# Altium schematic sheet MCU.SchDoc: ESP32-PICO, STM32F4
size 420 x 297 mm; SheetNumber: 6
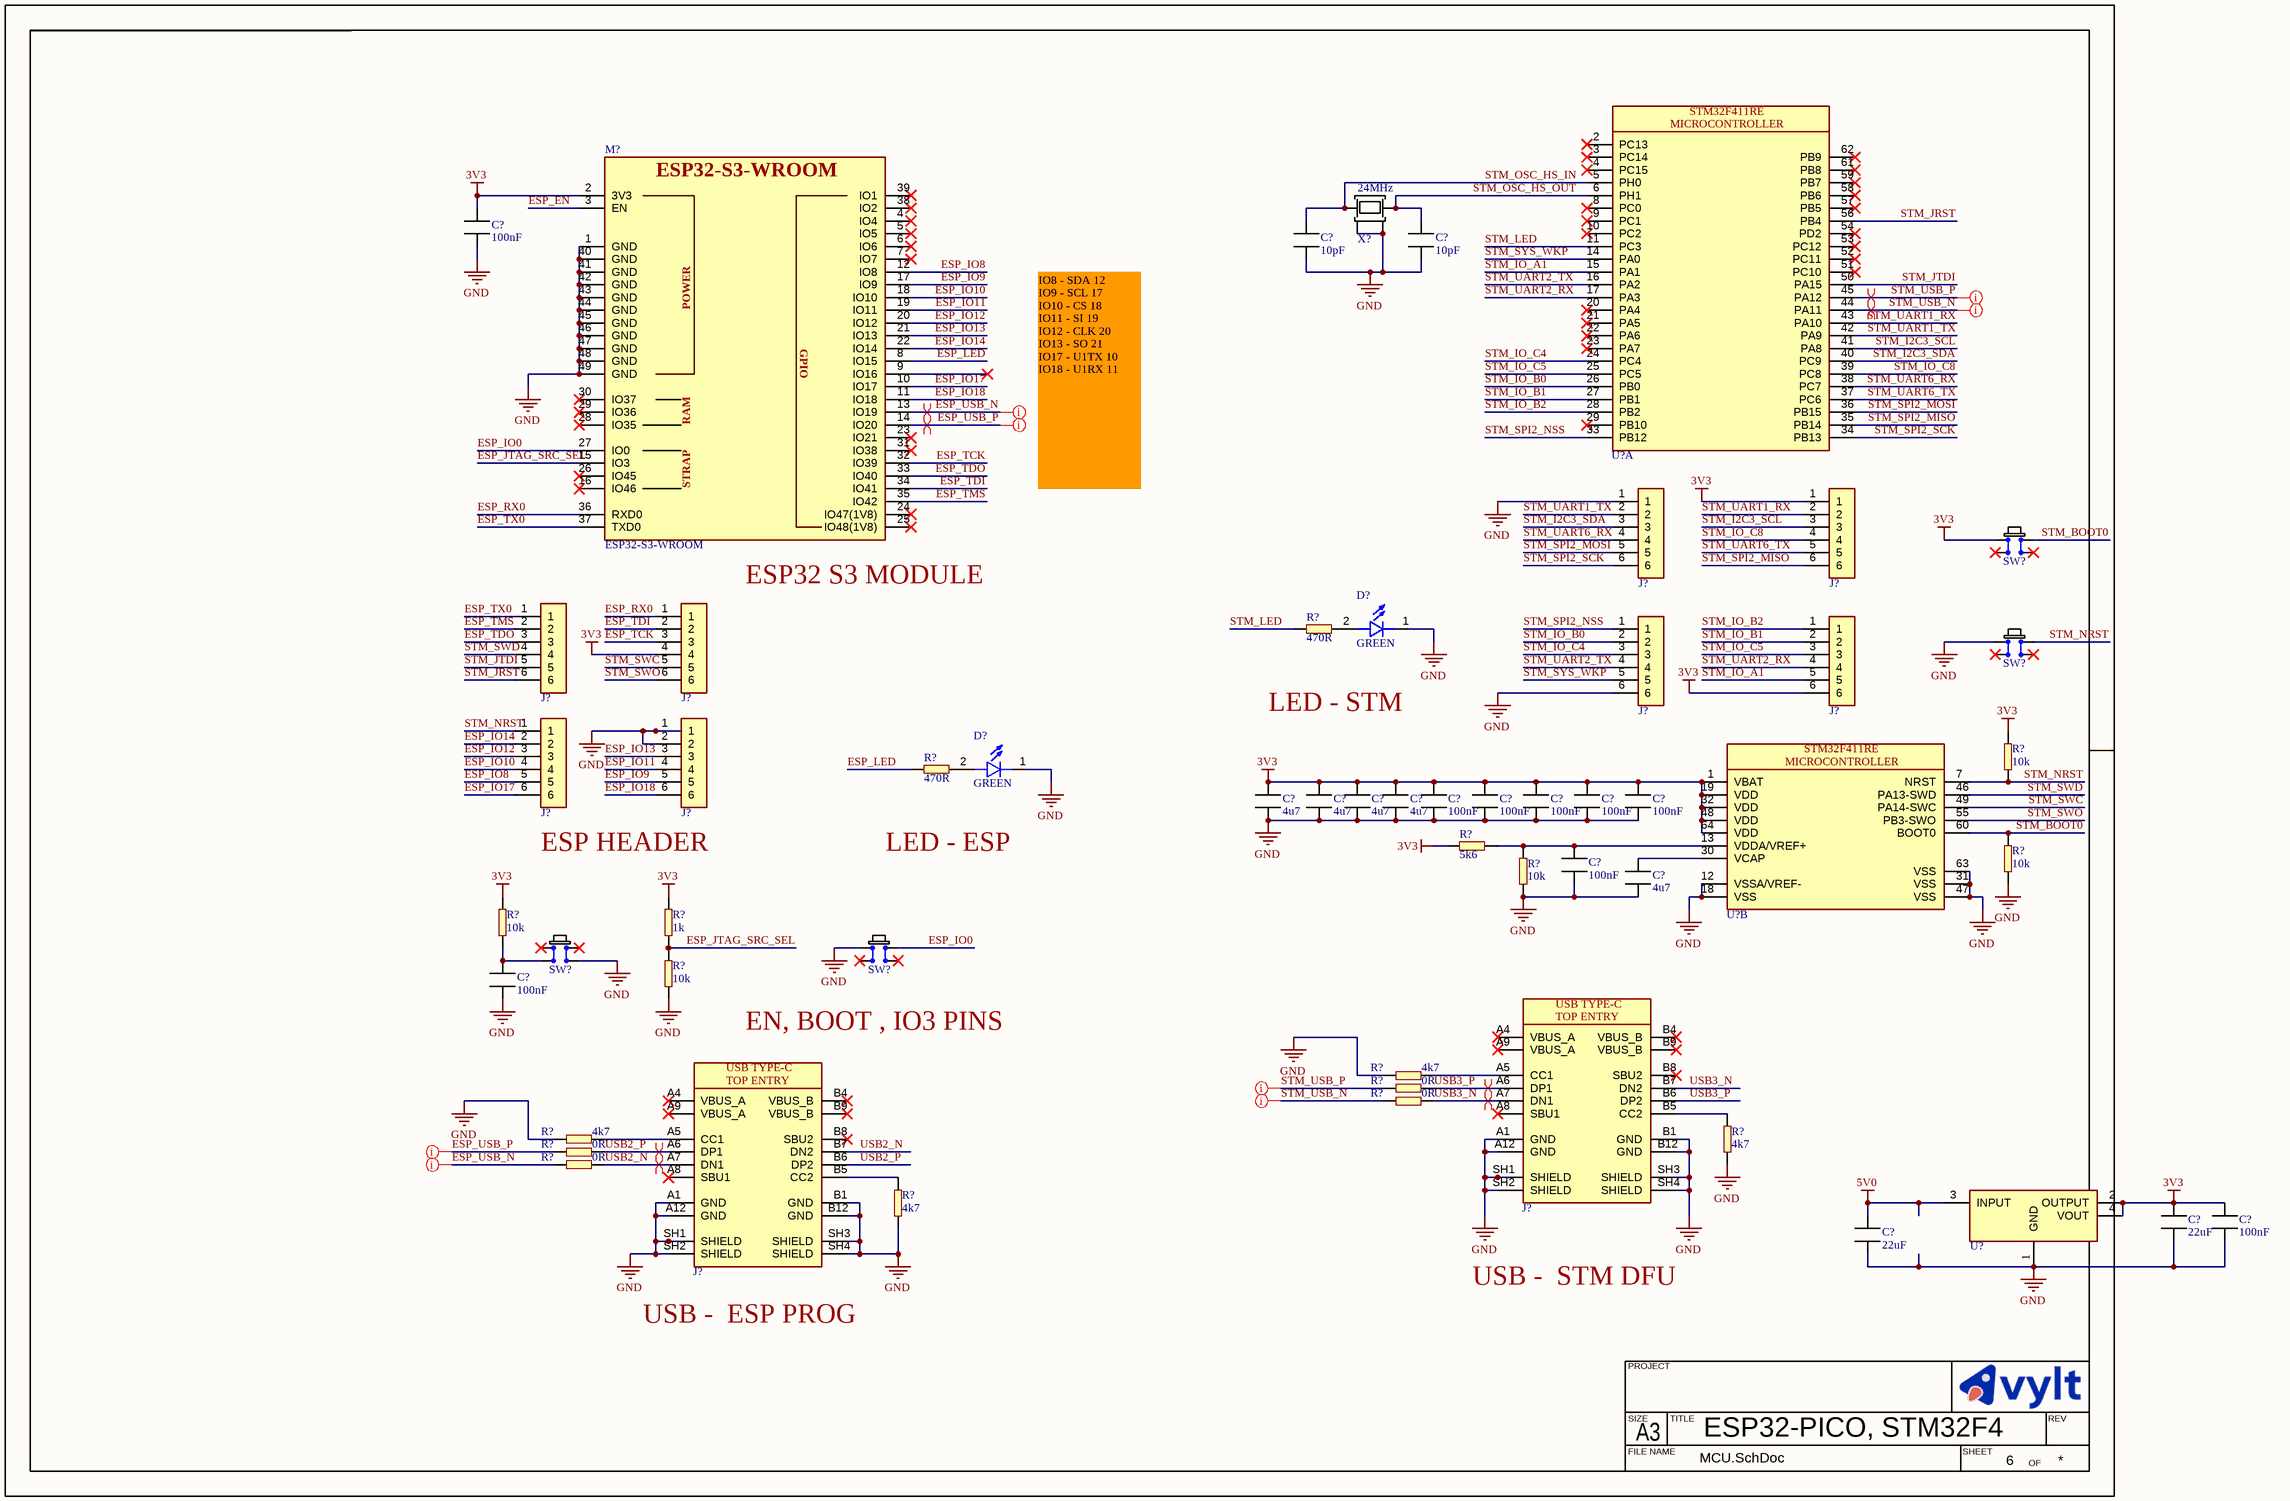
[diagram p0: MCU.SchDoc]

## Parts
(Parts that share a designator on the sheet are numbered #1, #2 ... from top to bottom, then left to right.)
C?#1  value 10pF  [CAPC2012X13L]  (hidden comment: MLCC_0805)
C?#2  value 10pF  [CAPC2012X13L]  (hidden comment: MLCC_0805)
C?#3  value 100nF  [CAPC2012X13L]  (hidden comment: MLCC_0805)
C?#4  value 4u7  [CAPC2012X13L]  (hidden comment: MLCC_0805)
C?#5  value 4u7  [CAPC2012X13L]  (hidden comment: MLCC_0805)
C?#6  value 4u7  [CAPC2012X13L]  (hidden comment: MLCC_0805)
C?#7  value 4u7  [CAPC2012X13L]  (hidden comment: MLCC_0805)
C?#8  value 100nF  [CAPC2012X13L]  (hidden comment: MLCC_0805)
C?#9  value 100nF  [CAPC2012X13L]  (hidden comment: MLCC_0805)
C?#10  value 100nF  [CAPC2012X13L]  (hidden comment: MLCC_0805)
C?#11  value 100nF  [CAPC2012X13L]  (hidden comment: MLCC_0805)
C?#12  value 100nF  [CAPC2012X13L]  (hidden comment: MLCC_0805)
C?#13  value 100nF  [CAPC2012X13L]  (hidden comment: MLCC_0805)
C?#14  value 4u7  [CAPC2012X13L]  (hidden comment: MLCC_0805)
C?#15  value 100nF  [CAPC2012X13L]  (hidden comment: MLCC_0805)
C?#16  value 22uF  [CAPC2012X13L]  (hidden comment: MLCC_0805)
C?#17  value 100nF  [CAPC2012X13L]  (hidden comment: MLCC_0805)
C?#18  value 22uF  [CAPC2012X13L]  (hidden comment: MLCC_0805)
D?#1  value GREEN  [LED_1206]  (hidden comment: LED_1206)
D?#2  value GREEN  [LED_1206]  (hidden comment: LED_1206)
J?#1  ERP_148-2  [6PX1R_F]  (value not drawn)
J?#2  ERP_148-2  [6PX1R_F]  (value not drawn)
J?#3  ERP_148-2  [6PX1R_F]  (value not drawn)
J?#4  ERP_148-2  [6PX1R_F]  (value not drawn)
J?#5  ERP_148-2  [6PX1R_F]  (value not drawn)
J?#6  ERP_148-2  [6PX1R_F]  (value not drawn)
J?#7  ERP_148-2  [6PX1R_F]  (value not drawn)
J?#8  ERP_148-2  [6PX1R_F]  (value not drawn)
J?#9  GSB1CA11101DSHR  [GSB1CA11101DSHR]  (value not drawn)
J?#10  GSB1CA11101DSHR  [GSB1CA11101DSHR]  (value not drawn)
M?  value ESP32-S3-WROOM  [ESP32-S3-WROOM-1U]  (hidden comment: ESP32-S3-WROOM-1(U))
R?#1  value 470R  [RES_0603]  (hidden comment: ERP_101-1)
R?#2  value 470R  [RES_0603]  (hidden comment: ERP_101-1)
R?#3  value 10k  [RES_0603]  (hidden comment: ERP_101-1)
R?#4  value 10k  [RES_0603]  (hidden comment: ERP_101-1)
R?#5  value 5k6  [RES_0603]  (hidden comment: ERP_101-1)
R?#6  value 10k  [RES_0603]  (hidden comment: ERP_101-1)
R?#7  value 10k  [RES_0603]  (hidden comment: ERP_101-1)
R?#8  value 1k  [RES_0603]  (hidden comment: ERP_101-1)
R?#9  value 10k  [RES_0603]  (hidden comment: ERP_101-1)
R?#10  value 4k7  [RES_0603]  (hidden comment: ERP_101-1)
R?#11  value 0R  [RES_0603]  (hidden comment: ERP_101-1)
R?#12  value 0R  [RES_0603]  (hidden comment: ERP_101-1)
R?#13  value 4k7  [RES_0603]  (hidden comment: ERP_101-1)
R?#14  value 4k7  [RES_0603]  (hidden comment: ERP_101-1)
R?#15  value 0R  [RES_0603]  (hidden comment: ERP_101-1)
R?#16  value 0R  [RES_0603]  (hidden comment: ERP_101-1)
R?#17  value 4k7  [RES_0603]  (hidden comment: ERP_101-1)
SW?#1  Generic6X6  [Generic6X6]  (value not drawn)
SW?#2  Generic6X6  [Generic6X6]  (value not drawn)
SW?#3  Generic6X6  [Generic6X6]  (value not drawn)
SW?#4  Generic6X6  [Generic6X6]  (value not drawn)
U?#1  STM32F411RE  [TSQFP50P1200X1200X160-64L]  (value not drawn)  (part A of 2)
U?#2  STM32F411RE  [TSQFP50P1200X1200X160-64L]  (value not drawn)  (part B of 2)
U?#3  ERP_123-1  [AMS1117_SOT223]  (value not drawn)
X?  value 24MHz  [YSX321SL]  (hidden comment: ERP_111-1)

## Nets
3V3: C?#3.1 C?#4.1 C?#5.1 C?#6.1 C?#7.1 C?#8.1 C?#9.1 C?#10.1 C?#11.1 C?#12.1 C?#16.1 C?#17.1 J?#2.1 J?#4.4 J?#6.6 M?.2(3V3) R?#3.2 R?#5.2 R?#7.2 R?#8.2 SW?#1.1(NO) U?#2.1(VBAT) U?#2.19(VDD) U?#2.32(VDD) U?#2.48(VDD) U?#2.64(VDD) U?#3.2(OUTPUT) U?#3.4(VOUT)
5V0: C?#18.1 U?#3.3(INPUT)
GND: C?#1.1 C?#2.1 C?#3.2 C?#4.2 C?#5.2 C?#6.2 C?#7.2 C?#8.2 C?#9.2 C?#10.2 C?#11.2 C?#12.2 C?#13.2 C?#14.2 C?#15.2 C?#16.2 C?#17.2 C?#18.2 D?#1.1 D?#2.1 J?#1.1 J?#5.6 J?#8.1 J?#8.2 J?#9.A1(GND) J?#9.A12(GND) J?#9.B1(GND) J?#9.B12(GND) J?#9.SH1(SHIELD) J?#9.SH2(SHIELD) J?#9.SH3(SHIELD) J?#9.SH4(SHIELD) J?#10.A1(GND) J?#10.A12(GND) J?#10.B1(GND) J?#10.B12(GND) J?#10.SH1(SHIELD) J?#10.SH2(SHIELD) J?#10.SH3(SHIELD) J?#10.SH4(SHIELD) M?.1(GND) M?.40(GND) M?.41(GND) M?.42(GND) M?.43(GND) M?.44(GND) M?.45(GND) M?.46(GND) M?.47(GND) M?.48(GND) M?.49(GND) R?#4.2 R?#6.1 R?#9.1 R?#10.2 R?#13.2 R?#14.2 R?#17.2 SW?#2.1(NO) SW?#3.4(COM) SW?#4.1(NO) U?#2.12(VSSA/VREF-) U?#2.18(VSS) U?#2.31(VSS) U?#2.47(VSS) U?#2.63(VSS) U?#3.1(GND) X?.2 X?.4
ESP_EN: M?.3(EN)
ESP_IO0: M?.27(IO0) SW?#4.3(COM)
ESP_IO8: J?#7.5 M?.12(IO8)
ESP_IO9: J?#8.5 M?.17(IO9)
ESP_IO10: J?#7.4 M?.18(IO10)
ESP_IO11: J?#8.4 M?.19(IO11)
ESP_IO12: J?#7.3 M?.20(IO12)
ESP_IO13: J?#8.3 M?.21(IO13)
ESP_IO14: J?#7.2 M?.22(IO14)
ESP_IO17: J?#7.6 M?.10(IO17)
ESP_IO18: J?#8.6 M?.11(IO18)
ESP_JTAG_SRC_SEL: M?.15(IO3) R?#8.1 R?#9.2
ESP_LED: M?.8(IO15) R?#2.2
ESP_RX0: J?#4.1 M?.36(RXD0)
ESP_TCK: J?#4.3 M?.32(IO39)
ESP_TDI: J?#4.2 M?.34(IO41)
ESP_TDO: J?#3.3 M?.33(IO40)
ESP_TMS: J?#3.2 M?.35(IO42)
ESP_TX0: J?#3.1 M?.37(TXD0)
ESP_USB_N: M?.13(IO19) R?#16.2
ESP_USB_P: M?.14(IO20) R?#15.2
STM_BOOT0: R?#4.1 SW?#1.3(COM) U?#2.60(BOOT0)
STM_I2C3_SCL: J?#2.3 U?#1.41(PA8)
STM_I2C3_SDA: J?#1.3 U?#1.40(PC9)
STM_IO_A1: J?#6.5 U?#1.15(PA1)
STM_IO_B0: J?#5.2 U?#1.26(PB0)
STM_IO_B1: J?#6.2 U?#1.27(PB1)
STM_IO_B2: J?#6.1 U?#1.28(PB2)
STM_IO_C4: J?#5.3 U?#1.24(PC4)
STM_IO_C5: J?#6.3 U?#1.25(PC5)
STM_IO_C8: J?#2.4 U?#1.39(PC8)
STM_JRST: J?#3.6 U?#1.56(PB4)
STM_JTDI: J?#3.5 U?#1.50(PA15)
STM_LED: R?#1.2 U?#1.11(PC3)
STM_NRST: J?#7.1 R?#3.1 SW?#2.3(COM) U?#2.7(NRST)
STM_OSC_HS_IN: C?#1.2 U?#1.5(PH0) X?.1
STM_OSC_HS_OUT: C?#2.2 U?#1.6(PH1) X?.3
STM_SPI2_MISO: J?#2.6 U?#1.35(PB14)
STM_SPI2_MOSI: J?#1.5 U?#1.36(PB15)
STM_SPI2_NSS: J?#5.1 U?#1.33(PB12)
STM_SPI2_SCK: J?#1.6 U?#1.34(PB13)
STM_SWC: J?#4.5 U?#2.49(PA14-SWC)
STM_SWD: J?#3.4 U?#2.46(PA13-SWD)
STM_SWO: J?#4.6 U?#2.55(PB3-SWO)
STM_SYS_WKP: J?#5.5 U?#1.14(PA0)
STM_UART1_RX: J?#2.2 U?#1.43(PA10)
STM_UART1_TX: J?#1.2 U?#1.42(PA9)
STM_UART2_RX: J?#6.4 U?#1.17(PA3)
STM_UART2_TX: J?#5.4 U?#1.16(PA2)
STM_UART6_RX: J?#1.4 U?#1.38(PC7)
STM_UART6_TX: J?#2.5 U?#1.37(PC6)
STM_USB_N: R?#12.2 U?#1.44(PA11)
STM_USB_P: R?#11.2 U?#1.45(PA12)
USB2_N: J?#10.A7(DN1) J?#10.B7(DN2) R?#16.1
USB2_P: J?#10.A6(DP1) J?#10.B6(DP2) R?#15.1
USB3_N: J?#9.A7(DN1) J?#9.B7(DN2) R?#12.1
USB3_P: J?#9.A6(DP1) J?#9.B6(DP2) R?#11.1
NetC?#13_1: C?#13.1 R?#5.1 R?#6.2 U?#2.13(VDDA/VREF+)
NetC?#14_1: C?#14.1 U?#2.30(VCAP)
NetC?#15_1: C?#15.1 R?#7.1 SW?#3.2(NO)
NetD?#1_2: D?#1.2 R?#1.1
NetD?#2_2: D?#2.2 R?#2.1
NetJ?#9_A5: J?#9.A5(CC1) R?#10.1
NetJ?#9_B5: J?#9.B5(CC2) R?#13.1
NetJ?#10_A5: J?#10.A5(CC1) R?#14.1
NetJ?#10_B5: J?#10.B5(CC2) R?#17.1

Not connected (* = marked no-connect by the designer): J?#9 A4(VBUS_A)* A8(SBU1)* A9(VBUS_A)* B4(VBUS_B)* B8(SBU2)* B9(VBUS_B)*; J?#10 A4(VBUS_A)* A8(SBU1)* A9(VBUS_A)* B4(VBUS_B)* B8(SBU2)* B9(VBUS_B)*; M? 4(IO4)* 5(IO5)* 6(IO6)* 7(IO7)* 9(IO16)* 16(IO46)* 23(IO21)* 24(IO47(1V8))* 25(IO48(1V8))* 26(IO45)* 28(IO35)* 29(IO36)* 30(IO37)* 31(IO38)* 38(IO2)* 39(IO1)*; SW?#1 2(NO)* 4(COM)*; SW?#2 2(NO)* 4(COM)*; SW?#3 1(NO)* 3(COM)*; SW?#4 2(NO)* 4(COM)*; U?#1 2(PC13)* 3(PC14)* 4(PC15)* 8(PC0)* 9(PC1)* 10(PC2)* 20(PA4)* 21(PA5)* 22(PA6)* 23(PA7)* 29(PB10)* 51(PC10)* 52(PC11)* 53(PC12)* 54(PD2)* 57(PB5)* 58(PB6)* 59(PB7)* 61(PB8)* 62(PB9)*

## Layout directives
differential pair; rule Differential Pairs Routing [Pref Gap = 7.006mil    Min Gap  = 7.006mil    Max Gap  = 7.006milPref Width = 7.275mil    Min Width  = 7.275mil    Max Width  = 7.275mil]: USB2_N, USB2_P, USB3_N, USB3_P
rule Differential Pairs Routing [Pref Gap = 7.006mil    Min Gap  = 7.006mil    Max Gap  = 7.006milPref Width = 7.275mil    Min Width  = 7.275mil    Max Width  = 7.275mil]; rule Routing Via Style [Pref Size = 0.7mm    Pref Hole Size = 0.4mm]: ESP_USB_N, ESP_USB_P, STM_USB_N, STM_USB_P
differential pair: ESP_USB_N, ESP_USB_P, STM_USB_N, STM_USB_P
rule Differential Pairs Routing [Pref Gap = 7.006mil    Min Gap  = 7.006mil    Max Gap  = 7.006milPref Width = 7.275mil    Min Width  = 7.275mil    Max Width  = 7.275mil]: ESP_USB_N, ESP_USB_P

## Notes on the sheet
- IO8 - SDA 12
  IO9 - SCL 17
  IO10 - CS 18
  IO11 - SI 19
  IO12 - CLK 20
  IO13 - SO 21
  IO17 - U1TX 10
  IO18 - U1RX 11
- (near M?) ESP32 S3 MODULE
- LED - STM
- (near J?#7) ESP HEADER
- LED - ESP
- EN, BOOT , IO3 PINS
- (near J?#10) USB -  ESP PROG
- USB -  STM DFU
- PROJECT
- SIZE
- FILE NAME
- A3
- TITLE
- SHEET
- OF
- REV
- (in symbol ESP32-S3-WROOM-1(U)) POWER; GPIO; RAM; STRAP
- (in symbol GSB1CA11101DSHR) USB TYPE-C; TOP ENTRY
- (in symbol STM32F411RE, part A) MICROCONTROLLER
- (in symbol STM32F411RE, part B) MICROCONTROLLER

## Library data of the parts
C?#1-C?#18 = MLCC_0805: Chip Capacitor, 2-Leads, Body 2.00x1.25mm, IPC High Density; Package: 0805; Manufacturer 1: *; Manufacturer Part Number 1: *
D?#1 D?#2 = LED_1206: LED CLEAR 1206 SMD; Manufacturer Part Number 1: 6395; Manufacturer 1: Sunrom
J?#1-J?#8 = 6PX1R_F: 6PX1R Female Header; Value: *; Manufacturer 1: *; Manufacturer Part Number 1: *
  J?#1: ComponentLink1Description: New link; ComponentLink1URL: *
J?#9 J?#10 = GSB1CA11101DSHR: USB-C (USB TYPE-C) USB 2.0 Receptacle Connector 24 (16+8 Dummy) Position Surface Mount, Through Hole; Manufacturer 1: Amphenol ICC (Commercial Products); Value: MUP-U23010-02; Manufacturer Part Number 1: GSB1CA11101DSHR; Package: 24 (16+8 Dummy)
M? = ESP32-S3-WROOM-1(U): ESP32-S3-WROOM 1/1U Module; Manufacturer 1: Espressif Systems; Manufacturer Part Number 1: *; Package: *
R?#1-R?#17 = RES_0603: Package: 0603; Manufacturer 1: *; Manufacturer Part Number 1: *
  R?#1 R?#2: ERP: *
SW?#1-SW?#4 = Generic6X6: Tactile Switch SPST-NO Top Actuated Surface Mount; Manufacturer 1: C&K; Manufacturer Part Number 1: *; Package: 4.5X4.5
U?#1 U?#2 = STM32F411RE: Manufacturer 1: STMicroelectronics; Manufacturer Part Number 1: STM32F411RET6; Supplier 1: Evelta; Supplier Part Number 1: 033-STM32F411RET6; Value: STM32F4; Package: LQFP-64
U?#3 = AMS1117_SOT223: AMS1117 LDO; Manufacturer Part Number 1: TLV1117LV33DCYR; Manufacturer 1: TI; Supplier  Part Number 1: *; Supplier  1: *; Package: SOT223
X? = YSX321SL: CRYS_L3.2_W2.5; Manufacturer 1: YXC; Manufacturer Part Number 1: *